# Altium project DxlServo.PrjPcb
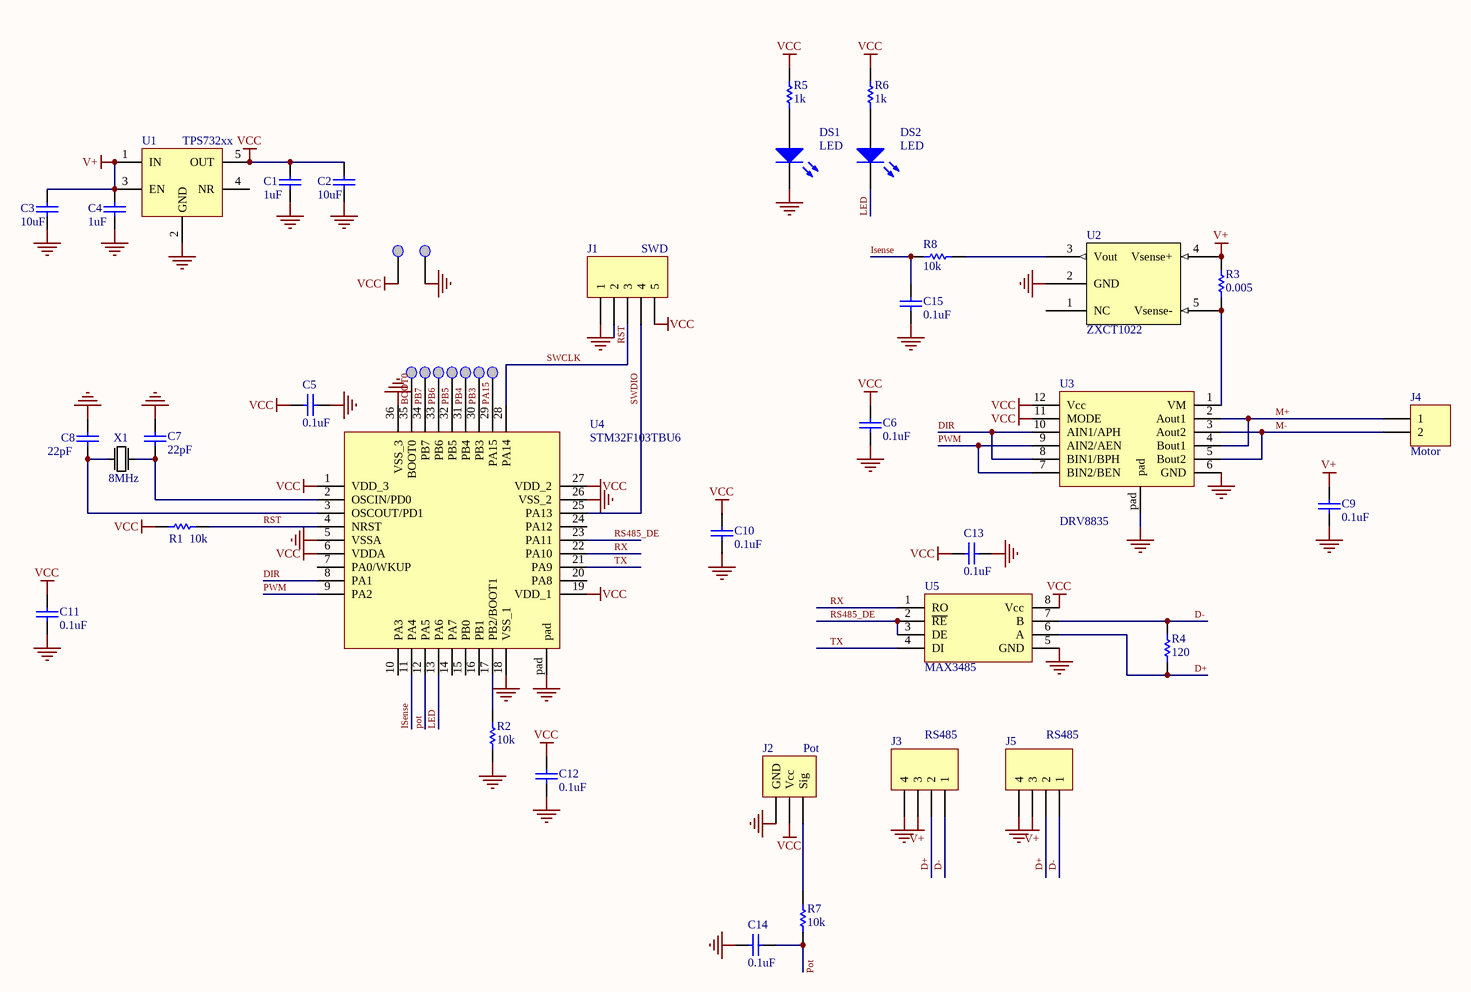
[diagram p0: DxlServo.SchDoc]
1 sheet, 45 parts. Net scope: global (net labels, ports and power ports of the same name join across sheets).

## Sheet DxlServo.SchDoc
size A2

### Parts
C1  value 1uF  [Cap SMD 0603]  (hidden comment: Cap)
C2  value 10uF  [Cap SMD 0805A]  (hidden comment: Cap)
C3  value 10uF  [Cap SMD 0805A]  (hidden comment: Cap)
C4  value 1uF  [Cap SMD 0603]  (hidden comment: Cap)
C5  value 0.1uF  [Cap SMD 0603]  (hidden comment: Cap)
C6  value 0.1uF  [Cap SMD 0603]  (hidden comment: Cap)
C7  value 22pF  [Cap SMD 0603]  (hidden comment: Cap)
C8  value 22pF  [Cap SMD 0603]  (hidden comment: Cap)
C9  value 0.1uF  [Cap SMD 0603]  (hidden comment: Cap)
C10  value 0.1uF  [Cap SMD 0603]  (hidden comment: Cap)
C11  value 0.1uF  [Cap SMD 0603]  (hidden comment: Cap)
C12  value 0.1uF  [Cap SMD 0603]  (hidden comment: Cap)
C13  value 0.1uF  [Cap SMD 0603]  (hidden comment: Cap)
C14  value 0.1uF  [Cap SMD 0603]  (hidden comment: Cap)
C15  value 0.1uF  [Cap SMD 0603]  (hidden comment: Cap)
DS1  LED  [LED SMD 0603]
DS2  LED  [LED SMD 0603]
J1  SWD  [HDR1x5]
J2  Pot  [HDR1X3]
J3  RS485  [Molex 2.5mm 4way vertical]
J4  Motor  [HDR1X2]
J5  RS485  [Molex 2.5mm 4way vertical]
R1  value 10k  [Res SMD 0603]  (hidden comment: Res1)
R2  value 10k  [Res SMD 0603]  (hidden comment: Res1)
R3  value 0.005  [Res SMD 0805A]  (hidden comment: Res1)
R4  value 120  [Res SMD 0805A]  (hidden comment: Res1)
R5  value 1k  [Res SMD 0603]  (hidden comment: Res1)
R6  value 1k  [Res SMD 0603]  (hidden comment: Res1)
R7  value 10k  [Res SMD 0603]  (hidden comment: Res1)
R8  value 10k  [Res SMD 0603]  (hidden comment: Res1)
TP1  Test Point  [TestPoint through hole small]  (value not drawn)
TP3  Test Point  [TestPoint through hole small]  (value not drawn)
TP4  Test Point  [TestPoint through hole small]  (value not drawn)
TP5  Test Point  [TestPoint through hole small]  (value not drawn)
TP6  Test Point  [TestPoint through hole small]  (value not drawn)
TP7  Test Point  [TestPoint through hole small]  (value not drawn)
TP8  Test Point  [TestPoint through hole small]  (value not drawn)
TP9  Test Point  [TestPoint through hole small]  (value not drawn)
TP10  Test Point  [TestPoint through hole small]  (value not drawn)
U1  TPS732xx  [SOT-23-5]
U2  ZXCT1022  [SOT-23-5]
U3  DRV8835  [WSON12]
U4  STM32F103TBU6  [VFQFPN-36]
U5  MAX3485  [SOIC8]
X1  value 8MHz  [ABM3]  (hidden comment: XTAL)

### Nets
GND: C1.2 C2.2 C3.2 C4.2 C5.1 C6.1 C7.1 C8.1 C9.1 C10.1 C11.1 C12.1 C13.1 C14.2 C15.2 DS1.K J1.1 J2.1(GND) J3.4 J5.4 R2.2 TP3.1 U1.2(GND) U2.2(GND) U3.6(GND) U3.pad U4.5(VSSA) U4.18(VSS_1) U4.26(VSS_2) U4.36(VSS_3) U4.pad U5.5(GND)
V+: C3.1 C4.1 C9.2 J3.3 J5.3 R3.1 U1.1(IN) U1.3(EN) U2.4(Vsense+)
VCC: C1.1 C2.1 C5.2 C6.2 C10.2 C11.2 C12.2 C13.2 J1.5 J2.2(Vcc) R1.2 R5.1 R6.1 TP1.1 U1.5(OUT) U3.11(MODE) U3.12(Vcc) U4.1(VDD_3) U4.6(VDDA) U4.19(VDD_1) U4.27(VDD_2) U5.8(Vcc)
BOOT0: TP4.1 U4.35(BOOT0)
D+: J3.2 J5.2 R4.2 U5.6(A)
D-: J3.1 J5.1 R4.1 U5.7(B)
DIR: U3.8(BIN1/BPH) U3.10(AIN1/APH) U4.8(PA1)
ISense: C15.1 R8.1 U4.11(PA4)
LED: DS2.K U4.13(PA6)
M+: J4.1 U3.2(Aout1) U3.4(Bout1)
M-: J4.2 U3.3(Aout2) U3.5(Bout2)
PA15: TP10.1 U4.29(PA15)
PB3: TP9.1 U4.30(PB3)
PB4: TP8.1 U4.31(PB4)
PB5: TP7.1 U4.32(PB5)
PB6: TP6.1 U4.33(PB6)
PB7: TP5.1 U4.34(PB7)
Pot: C14.1 R7.2 U4.12(PA5)
PWM: U3.7(BIN2/BEN) U3.9(AIN2/AEN) U4.9(PA2)
RS485_DE: U4.23(PA11) U5.2(~{RE}) U5.3(DE)
RST: J1.2 R1.1 U4.4(NRST)
RX: U4.22(PA10) U5.1(RO)
SWCLK: J1.3 U4.28(PA14)
SWDIO: J1.4 U4.25(PA13)
TX: U4.21(PA9) U5.4(DI)
NetC7_2: C7.2 U4.2(OSCIN/PD0) X1.1
NetC8_2: C8.2 U4.3(OSCOUT/PD1) X1.2
NetDS1_A: DS1.A R5.2
NetDS2_A: DS2.A R6.2
NetJ2_3: J2.3(Sig) R7.1
NetR2_1: R2.1 U4.17(PB2/BOOT1)
NetR3_2: R3.2 U2.5(Vsense-) U3.1(VM)
NetR8_2: R8.2 U2.3(Vout)

Not connected (* = marked no-connect by the designer): U1 4(NR); U2 1(NC); U4 7(PA0/WKUP) 10(PA3) 14(PA7) 15(PB0) 16(PB1) 20(PA8) 24(PA12)

### Library data of the parts
C1-C15 = Cap: Capacitor; Published: 8-Jun-2000; LatestRevisionDate: 17-Jul-2002; LatestRevisionNote: Re-released for DXP Platform.; PackageReference: RAD-0.3; Publisher: Altium Limited; PackageDescription: Radial Cap, Thru-Hole; 2 Leads; 0.3 in Pin Spacing
DS1 DS2 = LED: RGB LED Common Anode; Published: 8-Jun-2000; Revision: July-2002: Re-released for DXP Platform.; Publisher: Altium Limited
J1 = Header 5: Header, 5-Pin; LatestRevisionDate: 17-Jul-2002; LatestRevisionNote: Re-released for DXP Platform.; Publisher: Altium Limited
J2 = Header 3: Header, 3-Pin; LatestRevisionDate: 17-Jul-2002; LatestRevisionNote: Re-released for DXP Platform.; Publisher: Altium Limited
J3 J5 = Header 4: Header, 4-Pin; LatestRevisionDate: 17-Jul-2002; LatestRevisionNote: Re-released for DXP Platform.; Publisher: Altium Limited
J4 = Header 2: Header, 2-Pin; LatestRevisionDate: 17-Jul-2002; LatestRevisionNote: Re-released for DXP Platform.; Publisher: Altium Limited
R1-R8 = Resistor
TP1 TP3-TP10 = TestPoint
U1 = TPS732xx LDO: TPS732xx LDO Voltage Regulator
U3 = DRV8835: DRV8835 Dual Low-Voltage H-Bridge IC
U4 = STM32F103Txxx
U5 = MAX485
X1 = Crystal